# Altium schematic sheet 4_MOTORES_DC.SchDoc
size Tabloid; SheetNumber: 4; SheetTotal: 5; SPICEModelCacheNJINFHSP: <root> / <DocumentId>NJINFHSP</DocumentId> / <CacheFrame Number="0"> / <Model Name="0603_885012206121_330nf" Kind="CKT"> / <Text>******* / .subckt 0603_885012206121_330nF 1 2 / Rser 1 3 0.0116331902783 / Lser 2 4 2.98906197E-10 / C1 3 4 0.00000033 / Rpar 3 4 1500000000 / .ends 0603_885012206121_330nF</Text> / </Model> / <Model Name="865080645012_47uf" Kind="CKT"> / <Text>******* / .subckt 865080645012_47uF 1 2 / Rser 1 3 0.49 / Lser 2 4 0.000000002503 / C1 3 4 0.000047 / Rpar 3 4 2127659.57446809 / .ends 865080645012_47uF</Text> / </Model> / <Model Name="0603_150060rs75003" Kind="CKT"> / <Text>****** / .subckt 0603_150060RS75003  1  2 / D1 1 2 SMCW / .MODEL SMCW D / + IS=1.0025E-15 / + N=2.2259 / + RS=.3926 / + IKF=240.91E-6 / + CJO=1.0000E-12 / + M=.3333 / + VJ=.75 / + BV=5 / + IBV=10.00E-6 / + TT=5.0000E-9 / .ends</Text> / </Model> / <Model Name="0603_885012206049_330nf" Kind="CKT"> / <Text>******* / .subckt 0603_885012206049_330nF 1 2 / Rser 1 3 0.0117878976558 / Lser 2 4 3.9313295E-10 / C1 3 4 0.00000033 / Rpar 3 4 1500000000 / .ends 0603_885012206049_330nF</Text> / </Model> / <Model Name="0603_885012206040_10nf" Kind="CKT"> / <Text>******* / .subckt 0603_885012206040_10nF 1 2 / Rser 1 3 0.06145 / Lser 2 4 0.00000000036058 / C1 3 4 0.00000001 / Rpar 3 4 10000000000 / .ends 0603_885012206040_10nF</Text> / </Model> / <Model Name="0603_885012206034_1nf" Kind="CKT"> / <Text>******* / .subckt 0603_885012206034_1nF 1 2 / Rser 1 3 0.2266 / Lser 2 4 0.00000000040041 / C1 3 4 0.000000001 / Rpar 3 4 10000000000 / .ends 0603_885012206034_1nF</Text> / </Model> / </CacheFrame> / </root>
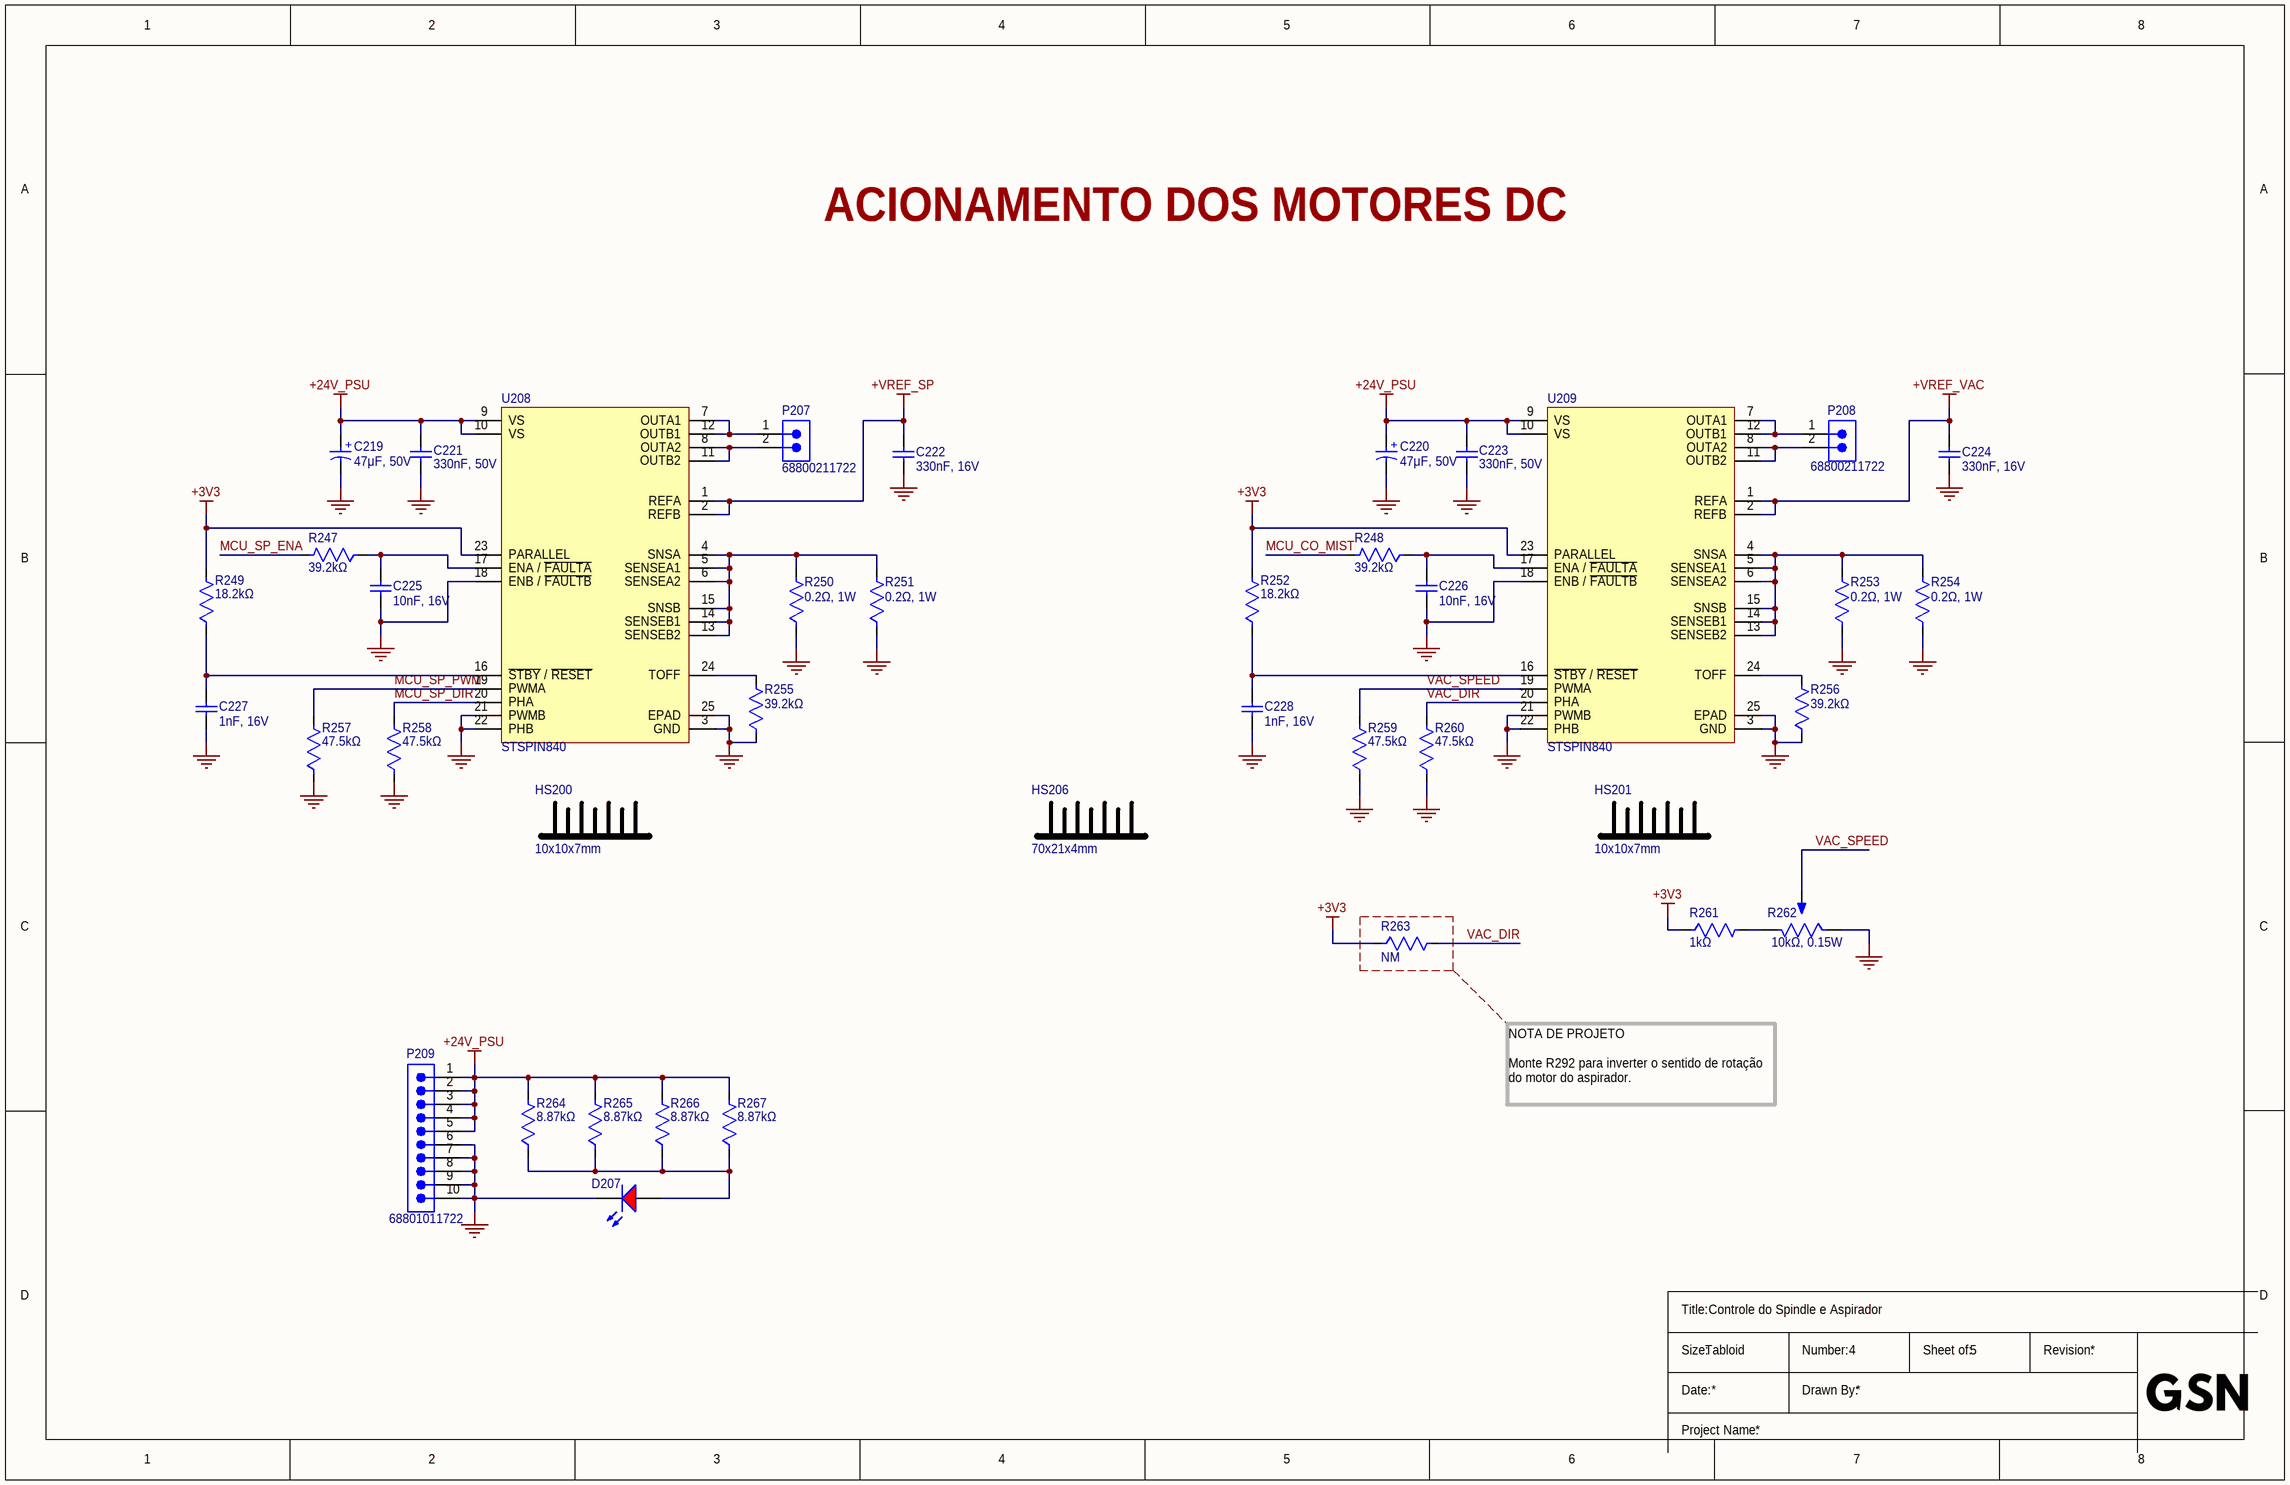
[diagram p0: 4_MOTORES_DC.SchDoc]

## Parts
C219  47μF, 50V  [WCAP-ASLI_D6.3H7.7]
C220  47μF, 50V  [WCAP-ASLI_D6.3H7.7]
C221  330nF, 50V  [WCAP-CSGP_0603_L1.6W0.8H0.8_Wave]
C222  330nF, 16V  [WCAP-CSGP_0603_L1.6W0.8H0.8_Wave]
C223  330nF, 50V  [WCAP-CSGP_0603_L1.6W0.8H0.8_Wave]
C224  330nF, 16V  [WCAP-CSGP_0603_L1.6W0.8H0.8_Wave]
C225  10nF, 16V  [WCAP-CSGP_0603_L1.6W0.8H0.8_Wave]
C226  10nF, 16V  [WCAP-CSGP_0603_L1.6W0.8H0.8_Wave]
C227  1nF, 16V  [WCAP-CSGP_0603_L1.6W0.8H0.8_Wave]
C228  1nF, 16V  [WCAP-CSGP_0603_L1.6W0.8H0.8_Wave]
D207  Red, 2V, 140deg  [WL-SMCW_0603_150060xx75003]  (value not drawn)
HS200  10x10x7mm  [HEATSINK_10MM_10MM_7MM]
HS201  10x10x7mm  [HEATSINK_10MM_10MM_7MM]
HS206  70x21x4mm  [HEATSINK_70MM_21MM_4MM]
P207  68800211722  [68800211722]
P208  68800211722  [68800211722]
P209  68801011722  [68801011722]
R247  39.2kΩ  [0603-WAVE]
R248  39.2kΩ  [0603-WAVE]
R249  18.2kΩ  [0603-WAVE]
R250  0.2Ω, 1W  [2512-WAVE]
R251  0.2Ω, 1W  [2512-WAVE]
R252  18.2kΩ  [0603-WAVE]
R253  0.2Ω, 1W  [2512-WAVE]
R254  0.2Ω, 1W  [2512-WAVE]
R255  39.2kΩ  [0603-WAVE]
R256  39.2kΩ  [0603-WAVE]
R257  47.5kΩ  [0603-WAVE]
R258  47.5kΩ  [0603-WAVE]
R259  47.5kΩ  [0603-WAVE]
R260  47.5kΩ  [0603-WAVE]
R261  1kΩ  [0603-WAVE]
R262  10kΩ, 0.15W  [TRIM-3P80MM_3P60MM]
R263  NM  [0603-WAVE]
R264  8.87kΩ  [0805-WAVE]
R265  8.87kΩ  [0805-WAVE]
R266  8.87kΩ  [0805-WAVE]
R267  8.87kΩ  [0805-WAVE]
U208  STSPIN840  [24-TQFPN]
U209  STSPIN840  [24-TQFPN]

## Nets
+3V3: R249.2 R252.2 R261.1 R263.1 U208.23(PARALLEL) U209.23(PARALLEL)
+24V_PSU: C219.1(P) C220.1(P) C221.2 C223.2 P209.1 P209.2 P209.3 P209.4 P209.5 R264.2 R265.2 R266.2 R267.2 U208.9(VS) U208.10(VS) U209.9(VS) U209.10(VS)
+VREF_SP: C222.2 U208.1(REFA) U208.2(REFB)
+VREF_VAC: C224.2 U209.1(REFA) U209.2(REFB)
GND: C219.2(N) C220.2(N) C221.1 C222.1 C223.1 C224.1 C225.1 C226.1 C227.1 C228.1 D207.2(K) P209.6 P209.7 P209.8 P209.9 P209.10 R250.1 R251.1 R253.1 R254.1 R255.1 R256.1 R257.1 R258.1 R259.1 R260.1 R262.1(CCW) U208.3(GND) U208.18(ENB_/_~{FAULTB}) U208.21(PWMB) U208.22(PHB) U208.25(EPAD) U209.3(GND) U209.18(ENB_/_~{FAULTB}) U209.21(PWMB) U209.22(PHB) U209.25(EPAD)
MCU_CO_MIST: R248.2
MCU_SP_DIR: R258.2 U208.20(PHA)
MCU_SP_ENA: R247.2
MCU_SP_PWM: R257.2 U208.19(PWMA)
VAC_DIR: R260.2 R263.2 U209.20(PHA)
VAC_SPEED: R259.2 R262.2(WIPER) U209.19(PWMA)
NetC225_2: C225.2 R247.1 U208.17(ENA_/_~{FAULTA})
NetC226_2: C226.2 R248.1 U209.17(ENA_/_~{FAULTA})
NetC227_2: C227.2 R249.1 U208.16(~{STBY}_/_~{RESET})
NetC228_2: C228.2 R252.1 U209.16(~{STBY}_/_~{RESET})
NetD207_1: D207.1(A) R264.1 R265.1 R266.1 R267.1
NetP207_1: P207.1 U208.7(OUTA1) U208.12(OUTB1)
NetP207_2: P207.2 U208.8(OUTA2) U208.11(OUTB2)
NetP208_1: P208.1 U209.7(OUTA1) U209.12(OUTB1)
NetP208_2: P208.2 U209.8(OUTA2) U209.11(OUTB2)
NetR250_2: R250.2 R251.2 U208.4(SNSA) U208.5(SENSEA1) U208.6(SENSEA2) U208.13(SENSEB2) U208.14(SENSEB1) U208.15(SNSB)
NetR253_2: R253.2 R254.2 U209.4(SNSA) U209.5(SENSEA1) U209.6(SENSEA2) U209.13(SENSEB2) U209.14(SENSEB1) U209.15(SNSB)
NetR255_2: R255.2 U208.24(TOFF)
NetR256_2: R256.2 U209.24(TOFF)
NetR261_2: R261.2 R262.3(CW)

## Notes on the sheet
- ACIONAMENTO DOS MOTORES DC
- NOTA DE PROJETO
  Monte R292 para inverter o sentido de rotação do motor do aspirador.
- Controle do Spindle e Aspirador
- Title:
- Size:
- Tabloid
- Number:
- Sheet of:
- Revision:
- Date:
- Project Name:
- Drawn By:
- (in symbol 865080645012) +

## Library data of the parts
C219 C220 = 865080645012: WCAP-ASLI Aluminum Electrolytic Capacitor, V-Chip, SMT, 6.3mm x 7.7mm, 47μF, 50V; Manufacturer: Wurth Elektronik; Capacitance: 47uF; Dissipation Factor: 12%; Endurance: 2000h; Impedance: 700mohm; Leakage Current: 23.5uA; Ripple Current: 230mA; Manufacturer Part Number: 865080645012; Category: Aluminum Electrolytic Capacitors; Match Code: WCAP-ASLI; ComponentLink1Description: Website Link; ComponentLink1URL: https://www.we-online.com/redexpert/article/865080645012?ad; ComponentLink2Description: Datasheet Link; ComponentLink2URL: https://www.we-online.com/redexpert/spec/865080645012?ad; Mount: Surface Mount; Operating Temperature Min: -55degC; Operating Temperature Max: 105degC; Packaging: Tape and Reel; Height: 7.7mm; Diameter: 6.3mm; Rated Voltage (DC): 50V
C221 C223 = 885012206121: WCAP-CSGP Multilayer Ceramic Chip Capacitor, General Purpose, size 0603, 330nF, 50V; Manufacturer: Wurth Elektronik; Case/Size Code: 0603; Capacitance Tolerance: +/-10%; Ceramic Type: X7R; Dissipation Factor: 10%; Insulation Resistance: 1.5GΩ; Technical Reference: X7R0603334K050DFCT10000; Manufacturer Part Number: 885012206121; Category: Multilayer Ceramic Chip Capacitors; Match Code: WCAP-CSGP; ComponentLink1Description: Website Link; ComponentLink1URL: https://www.we-online.com/redexpert/article/885012206121?ad; ComponentLink2Description: Datasheet Link; ComponentLink2URL: https://www.we-online.com/redexpert/spec/885012206121?ad; Mount: Surface Mount; Min Operating Temperature: -55°C; Max Operating Temperature: 125°C; Packaging: Tape and Reel; Length: 1.6mm; Width: 0.8mm; Height: 0.8mm; Capacitance: 330nF; Rated Voltage (DC): 50V
C222 C224 = 885012206049: WCAP-CSGP Multilayer Ceramic Chip Capacitor, General Purpose, size 0603, 330nF, 16V; Manufacturer: Wurth Elektronik; Case/Size Code: 0603; Capacitance Tolerance: +/-10%; Ceramic Type: X7R; Dissipation Factor: 5%; Insulation Resistance: 1.5Gohm; Technical Reference: X7R0603334K016DFCT10000; Manufacturer Part Number: 885012206049; Category: Multilayer Ceramic Chip Capacitors; Match Code: WCAP-CSGP; ComponentLink1Description: Website Link; ComponentLink1URL: https://www.we-online.com/redexpert/article/885012206049?ad; ComponentLink2Description: Datasheet Link; ComponentLink2URL: https://www.we-online.com/redexpert/spec/885012206049?ad; Mount: Surface Mount; Operating Temperature Min: -55degC; Operating Temperature Max: 125degC; Packaging: Tape and Reel; Length: 1.6mm; Width: 0.8mm; Height: 0.8mm; Capacitance: 330nF; Rated Voltage (DC): 16V
C225 C226 = 885012206040: WCAP-CSGP Multilayer Ceramic Chip Capacitor, General Purpose, size 0603, 10nF, 16V; Manufacturer: Wurth Elektronik; Case/Size Code: 0603; Capacitance Tolerance: +/-10%; Ceramic Type: X7R; Dissipation Factor: 3.5%; Insulation Resistance: 10Gohm; Technical Reference: X7R0603103K016DFCT10000; Manufacturer Part Number: 885012206040; Category: Multilayer Ceramic Chip Capacitors; Match Code: WCAP-CSGP; ComponentLink1Description: Website Link; ComponentLink1URL: https://www.we-online.com/redexpert/article/885012206040?ad; ComponentLink2Description: Datasheet Link; ComponentLink2URL: https://www.we-online.com/redexpert/spec/885012206040?ad; Mount: Surface Mount; Operating Temperature Min: -55degC; Operating Temperature Max: 125degC; Packaging: Tape and Reel; Length: 1.6mm; Width: 0.8mm; Height: 0.8mm; Capacitance: 10nF; Rated Voltage (DC): 16V
C227 C228 = 885012206034: WCAP-CSGP Multilayer Ceramic Chip Capacitor, General Purpose, size 0603, 1nF, 16V; Manufacturer: Wurth Elektronik; Case/Size Code: 0603; Capacitance Tolerance: +/-10%; Ceramic Type: X7R; Dissipation Factor: 3.5%; Insulation Resistance: 10Gohm; Technical Reference: X7R0603102K016DFCT10000; Manufacturer Part Number: 885012206034; Category: Multilayer Ceramic Chip Capacitors; Match Code: WCAP-CSGP; ComponentLink1Description: Website Link; ComponentLink1URL: https://www.we-online.com/redexpert/article/885012206034?ad; ComponentLink2Description: Datasheet Link; ComponentLink2URL: https://www.we-online.com/redexpert/spec/885012206034?ad; Mount: Surface Mount; Operating Temperature Min: -55degC; Operating Temperature Max: 125degC; Packaging: Tape and Reel; Length: 1.6mm; Width: 0.8mm; Height: 0.8mm; Capacitance: 1nF; Rated Voltage (DC): 16V
D207 = 150060RS75003: WL-SMCW Mono-color Chip LED Waterclear, SMT, size 0603, Red, 2V, 140°; Manufacturer: Wurth Elektronik; Case/Size Code: 0603; Chip Technology: AlInGaP; Dominant Wavelength: 625nm; Luminous Intensity: 530mcd; Peak Wavelength: 630nm; Manufacturer Part Number: 150060RS75003; Category: Signal LEDs; Match Code: WL-SMCW; ComponentLink1Description: Website Link; ComponentLink1URL: https://www.we-online.com/redexpert/article/150060RS75003?ad; ComponentLink2Description: Datasheet Link; ComponentLink2URL: https://www.we-online.com/redexpert/spec/150060RS75003?ad; Mount: Surface Mount; Operating Temperature Min: -40degC; Operating Temperature Max: 100degC; Packaging: Tape and Reel; Length: 1.6mm; Width: 0.8mm; Height: 0.7mm; Emitting Color: Red; Forward Voltage: 2V; Viewing Angle: 140deg
HS200 HS201 = GENERIC-HEATSINK-10X10X7MM: GENERIC HEATSINK 10X10X7MM; Manufacturer: OEM; Manufacturer Part Number: None
HS206 = GENERIC-HEATSINK-70X21X4MM: GENERIC HEATSINK 70X21X4MM; Manufacturer: OEM; Manufacturer Part Number: None
P207 P208 = 68800211722: WR-WTB “J” Type THT Male Horizontal Shrouded Header, pitch 2.5 mm, 2 pins; Manufacturer: Wurth Elektronik; Contact Resistance: 20 mohm; Rated Current: 3 A; Working Voltage: 250 V(AC); Withstanding Voltage: 800 V(AC); Manufacturer Part Number: 68800211722; Category: Wire-to-Board Connector; Match Code: WR-WTB; ComponentLink1Description: Website Link; ComponentLink1URL: https://www.we-online.com/redexpert/article/68800211722?ad; ComponentLink2Description: Datasheet Link; ComponentLink2URL: https://www.we-online.com/redexpert/spec/68800211722?ad; Mount: Through Hole; Operating Temperature Min: -25degC; Operating Temperature Max: 85degC; Packaging: Bag; Length: 7.5 mm; Width: 8.3 mm; Height: 4.2 mm; Gender: Male; Number of Pins: 2; Number of Rows: 1; Orientation: Horizontal; Lead Pitch: 2.5 mm
P209 = 68801011722: WR-WTB “J” Type THT Male Horizontal Shrouded Header, pitch 2.5 mm, 10 pins; Manufacturer: Wurth Elektronik; Contact Resistance: 20 mohm; Rated Current: 3 A; Working Voltage: 250 V(AC); Withstanding Voltage: 800 V(AC); Manufacturer Part Number: 68801011722; Category: Wire-to-Board Connector; Match Code: WR-WTB; ComponentLink1Description: Website Link; ComponentLink1URL: https://www.we-online.com/redexpert/article/68801011722?ad; ComponentLink2Description: Datasheet Link; ComponentLink2URL: https://www.we-online.com/redexpert/spec/68801011722?ad; Mount: Through Hole; Operating Temperature Min: -25degC; Operating Temperature Max: 85degC; Packaging: Bag; Length: 27.5 mm; Width: 8.3 mm; Height: 4.2 mm; Gender: Male; Number of Pins: 10; Number of Rows: 1; Orientation: Horizontal; Lead Pitch: 2.5 mm
R247 R248 R255 R256 = RC0603FR-0739K2L: RES 39.2K OHM 1% 1/10W 0603; Manufacturer: Yageo Group; Max Power Dissipation: 100mW; Temperature Coefficient: ±200ppm/°C; Voltage Rating (AC): 50V; Voltage Rating: 75V; Supplier Part Number: 311-39.2KHRCT-ND; Manufacturer Part Number: RC0603FR-0739K2L; Value: 39.2kΩ; Case Code (Imperial): 0603; Case Code (Metric): 1608; Case/Package: 0603; Category: Chip SMD Resistors; China RoHS: Non-Compliant; Composition: Thick Film; Contact Plating: Tin; Depth: 800µm; Features: Moisture Resistant; Height: 450µm; Lead Free: Lead Free; Length: 1.6mm; Lifecycle Status: Production; Max Operating Temperature: 155°C; Military Standard: Not; Min Operating Temperature: -55°C; Mounting Technology: Surface Mount; Number of Terminals: 2; Number of Terminations: 2; Packaging: Tape & Reel; Power Dissipation: 100mW; Power Rating: 100mW; Radiation Hardening: No; REACH SVHC: Yes; RoHS: Compliant; Supplier: DigiKey; Termination: SMD/SMT; Tolerance: 1%; Component Link Description: https://www.yageogroup.com/content/datasheet/asset/file/PYU-RC_GROUP_51_ROHS_L; Component Link URL: https://www.yageogroup.com/content/datasheet/asset/file/PYU-RC_GROUP_51_ROHS_L; Datasheet: https://www.yageogroup.com/content/datasheet/asset/file/PYU-RC_GROUP_51_ROHS_L; Voltage Rating (DC): 50V; Weight: 2.012816mg; Width: 800µm; Working Voltage: 75V
R249 R252 = RC0603FR-0718K2L: RES 18.2K OHM 1% 1/10W 0603; Manufacturer: Yageo Group; Max Power Dissipation: 100mW; Temperature Coefficient: ±200ppm/°C; Voltage Rating (AC): 50V; Voltage Rating: 75V; Supplier Part Number: 311-18.2KHRCT-ND; Manufacturer Part Number: RC0603FR-0718K2L; Value: 18.2kΩ; Case Code (Imperial): 0603; Case Code (Metric): 1608; Case/Package: 0603; Category: Chip SMD Resistors; China RoHS: Non-Compliant; Composition: Thick Film; Contact Plating: Tin; Depth: 800µm; Features: Moisture Resistant; Height: 450µm; Lead Free: Lead Free; Length: 1.6mm; Lifecycle Status: Production; Max Operating Temperature: 155°C; Military Standard: Not; Min Operating Temperature: -55°C; Mounting Technology: Surface Mount; Number of Terminals: 2; Number of Terminations: 2; Packaging: Tape & Reel; Power Dissipation: 100mW; Power Rating: 100mW; Radiation Hardening: No; REACH SVHC: Yes; RoHS: Compliant; Supplier: DigiKey; Termination: SMD/SMT; Tolerance: 1%; Component Link Description: https://www.yageogroup.com/content/datasheet/asset/file/PYU-RC_GROUP_51_ROHS_L; Component Link URL: https://www.yageogroup.com/content/datasheet/asset/file/PYU-RC_GROUP_51_ROHS_L; Datasheet: https://www.yageogroup.com/content/datasheet/asset/file/PYU-RC_GROUP_51_ROHS_L; Voltage Rating (DC): 50V; Weight: 2.012816mg; Width: 800µm; Working Voltage: 75V
R250 R251 R253 R254 = RL2512FK-070R2L: RES 0.2 OHM 1% 1W 2512; Manufacturer: Yageo Group; Value: 200mΩ; Temperature Coefficient: 600ppm/°C; Working Voltage: 447.2mV; Supplier: DigiKey; Supplier Part Number: 311-0.2TCT-ND; Manufacturer Part Number: RL2512FK-070R2L; RoHS: Compliant; Category: Chip SMD Resistors; Stock: 22890; Pricing: 1=0.44, 10=0.249, 25=0.206, 50=0.1814, 100=0.1618, 250=0.142, 500=0.13056, 1000=0.12148 (USD); Case/Package: 2512; Case Code (Imperial): 2512; Case Code (Metric): 6332; China RoHS: Non-Compliant; Composition: Thick Film; Contact Plating: Lead, Tin; Country of Origin: Mainland China, Taiwan; Depth: 3.2mm; Export Control Classification Number (ECCN) Code: EAR99; Height: 550µm; Harmonized Tariff Schedule (HTS) Code: 8533.21.00.30; Introduction Date: 2005-04-15; Lead Free: Lead Free; Length: 6.35mm; Lifecycle Status: Production; Max Operating Temperature: 155°C; Military Standard: Not; Min Operating Temperature: -55°C; Mounting Technology: Surface Mount; Number of Terminals: 2; Power Rating: 1W; Ratings: AEC-Q200; REACH SVHC: Yes; Schedule B: 8533210045, 8533210045|8533210045, 8533210045|8533210045|8533210045, 8533210045|8533210045|8533210045|8533210045; Termination: SMD/SMT; Tolerance: 1%; Weight: 40.511469mg; Width: 3.2mm; ComponentLink1URL: https://datasheet.octopart.com:443/RL2512FK-070R2L-Yageo-datasheet-182189623.pdf?src-supplier=IHS; ComponentLink1Description: https://datasheet.octopart.com:443/RL2512FK-070R2L-Yageo-datasheet-182189623.pdf?src-supplier=IHS; ComponentLink2URL: https://datasheet.octopart.com:443/RL2512FK-070R2L-Yageo-datasheet-83209227.pdf?src-supplier=LCSC; ComponentLink2Description: https://datasheet.octopart.com:443/RL2512FK-070R2L-Yageo-datasheet-83209227.pdf?src-supplier=LCSC; ComponentLink3URL: https://datasheet.octopart.com:443/RL2512FK-070R2L-Yageo-Group-datasheet-178203169.pdf?src-supplier=Future+Electronics; ComponentLink3Description: https://datasheet.octopart.com:443/RL2512FK-070R2L-Yageo-Group-datasheet-178203169.pdf?src-supplier=Future+Electronics; ComponentLink4URL: https://datasheet.octopart.com:443/RL2512FK-070R2L-Yageo-datasheet-137700928.pdf?src-supplier=Future+Electronics; ComponentLink4Description: https://datasheet.octopart.com:443/RL2512FK-070R2L-Yageo-datasheet-137700928.pdf?src-supplier=Future+Electronics; ComponentLink5URL: https://datasheet.octopart.com:443/RL2512FK-070R2L-Yageo-datasheet-42224166.pdf?src-supplier=Future+Electronics; ComponentLink5Description: https://datasheet.octopart.com:443/RL2512FK-070R2L-Yageo-datasheet-42224166.pdf?src-supplier=Future+Electronics; ComponentLink6URL: https://datasheet.octopart.com:443/RL2512FK-070R2L-Yageo-datasheet-21255488.pdf?src-supplier=Future+Electronics; ComponentLink6Description: https://datasheet.octopart.com:443/RL2512FK-070R2L-Yageo-datasheet-21255488.pdf?src-supplier=Future+Electronics; ComponentLink7URL: https://datasheet.octopart.com:443/RL2512FK-070R2L-Yageo-datasheet-12526708.pdf?src-supplier=Future+Electronics; ComponentLink7Description: https://datasheet.octopart.com:443/RL2512FK-070R2L-Yageo-datasheet-12526708.pdf?src-supplier=Future+Electronics; ComponentLink8URL: https://datasheet.octopart.com:443/RL2512FK-070R2L-Yageo-datasheet-12521612.pdf?src-supplier=Future+Electronics; ComponentLink8Description: https://datasheet.octopart.com:443/RL2512FK-070R2L-Yageo-datasheet-12521612.pdf?src-supplier=Future+Electronics; ComponentLink9URL: https://datasheet.octopart.com/RL2512FK-070R2L-Yageo-datasheet-10916029.pdf; ComponentLink9Description: https://datasheet.octopart.com/RL2512FK-070R2L-Yageo-datasheet-10916029.pdf; ComponentLink10URL: http://sigma.octopart.com:80/conflict_mineral_statement/Yageo-company-3.pdf?src-supplier=Compliance+Statements; ComponentLink10Description: http://sigma.octopart.com:80/conflict_mineral_statement/Yageo-company-3.pdf?src-supplier=Compliance+Statements; ComponentLink11URL: http://sigma.octopart.com:80/rohs_statement/Yageo-company-2.pdf?src-supplier=Compliance+Statements; ComponentLink11Description: http://sigma.octopart.com:80/rohs_statement/Yageo-company-2.pdf?src-supplier=Compliance+Statements
R257-R260 = RC0603FR-0747K5L: RES 47.5K OHM 1% 1/10W 0603; Manufacturer: Yageo Group; Max Power Dissipation: 100mW; Temperature Coefficient: ±200ppm/°C; Voltage Rating (AC): 50V; Voltage Rating: 75V; Supplier Part Number: 311-47.5KHRCT-ND; Manufacturer Part Number: RC0603FR-0747K5L; Value: 47.5kΩ; Case Code (Imperial): 0603; Case Code (Metric): 1608; Case/Package: 0603; Category: Chip SMD Resistors; China RoHS: Non-Compliant; Composition: Thick Film; Contact Plating: Tin; Depth: 800µm; Features: Moisture Resistant; Height: 450µm; Lead Free: Lead Free; Length: 1.6mm; Lifecycle Status: Production; Max Operating Temperature: 155°C; Military Standard: Not; Min Operating Temperature: -55°C; Mounting Technology: Surface Mount; Number of Terminals: 2; Number of Terminations: 2; Packaging: Tape & Reel; Power Dissipation: 100mW; Power Rating: 100mW; Radiation Hardening: No; REACH SVHC: Yes; RoHS: Compliant; Supplier: DigiKey; Termination: SMD/SMT; Tolerance: 1%; Component Link Description: https://www.yageogroup.com/content/datasheet/asset/file/PYU-RC_GROUP_51_ROHS_L; Component Link URL: https://www.yageogroup.com/content/datasheet/asset/file/PYU-RC_GROUP_51_ROHS_L; Datasheet: https://www.yageogroup.com/content/datasheet/asset/file/PYU-RC_GROUP_51_ROHS_L; Voltage Rating (DC): 50V; Weight: 2.012816mg; Width: 800µm; Working Voltage: 75V
R261 = RC0603FR-071KL: RES 1K OHM 1% 1/10W 0603; Manufacturer: Yageo Group; Max Power Dissipation: 100mW; Temperature Coefficient: ±200ppm/°C; Voltage Rating (AC): 50V; Voltage Rating: 75V; Supplier Part Number: 311-1.00KHRCT-ND; Manufacturer Part Number: RC0603FR-071KL; Value: 1kΩ; Case Code (Imperial): 0603; Case Code (Metric): 1608; Case/Package: 0603; Category: Chip SMD Resistors; China RoHS: Non-Compliant; Composition: Thick Film; Contact Plating: Tin; Depth: 800µm; Features: Moisture Resistant; Height: 450µm; Lead Free: Lead Free; Length: 1.6mm; Lifecycle Status: Production; Max Operating Temperature: 155°C; Military Standard: Not; Min Operating Temperature: -55°C; Mounting Technology: Surface Mount; Number of Terminals: 2; Number of Terminations: 2; Packaging: Tape & Reel; Power Dissipation: 100mW; Power Rating: 100mW; Radiation Hardening: No; REACH SVHC: Yes; RoHS: Compliant; Supplier: DigiKey; Termination: SMD/SMT; Tolerance: 1%; Component Link Description: https://www.yageogroup.com/content/datasheet/asset/file/PYU-RC_GROUP_51_ROHS_L; Component Link URL: https://www.yageogroup.com/content/datasheet/asset/file/PYU-RC_GROUP_51_ROHS_L; Datasheet: https://www.yageogroup.com/content/datasheet/asset/file/PYU-RC_GROUP_51_ROHS_L; Voltage Rating (DC): 50V; Weight: 2.012816mg; Width: 800µm; Working Voltage: 75V
R262 = TC33X-2-103E: TRIMMER 10K OHM 0.15W J LEAD TOP; Manufacturer: Bourns; Max Power Dissipation: 100mW; Number of Turns: 1; Power Dissipation: 150mW; Temperature Coefficient: 250ppm/°C; Tolerance: 25%; Voltage Rating (DC): 50V; Supplier: DigiKey; Supplier Part Number: TC33X-103ECT-ND; Manufacturer Part Number: TC33X-2-103E; RoHS: Compliant; Category: Variable Resistors and Potentiometers; Stock: 18061; Pricing: 1=0.25, 10=0.213, 25=0.1996, 50=0.1896, 100=0.18, 250=0.168, 500=0.15938, 1000=0.15119 (USD); Color: Silver; Composition: Cermet, Potentiometer; Contact Plating: Copper, Silver, Tin; Depth: 3.8mm; Height: 1.2mm; Lead Free: Lead Free; Length: 3mm; Lifecycle Status: Production; Max Operating Temperature: 100°C; Military Standard: Not; Min Operating Temperature: -40°C; Mounting Technology: Surface Mount; Number of Terminals: 3; Packaging: Cut Tape; Power Rating: 100mW; Radiation Hardening: No; REACH SVHC: Yes; Value: 10kΩ; Schedule B: 8533400080, 8533400080|8533400080|8533400080|8533400080|8533400080; Taper: Linear; Termination: Foot Print; Weight: 29.4mg; Width: 3.6mm; Working Voltage: 50V; ComponentLink1URL: https://datasheet.octopart.com:443/TC33X-2-103E-Bourns-datasheet-182142024.pdf?src-supplier=IHS; ComponentLink1Description: https://datasheet.octopart.com:443/TC33X-2-103E-Bourns-datasheet-182142024.pdf?src-supplier=IHS; ComponentLink2URL: https://datasheet.octopart.com:443/TC33X-2-103E-Bourns-datasheet-134530277.pdf?src-supplier=Upverter; ComponentLink2Description: https://datasheet.octopart.com:443/TC33X-2-103E-Bourns-datasheet-134530277.pdf?src-supplier=Upverter; ComponentLink3URL: https://datasheet.octopart.com:443/TC33X-2-103E-Bourns-datasheet-11551316.pdf?src-supplier=element14+APAC; ComponentLink3Description: https://datasheet.octopart.com:443/TC33X-2-103E-Bourns-datasheet-11551316.pdf?src-supplier=element14+APAC; ComponentLink4URL: https://datasheet.octopart.com:443/TC33X-2-103E-Bourns-datasheet-65566108.pdf?src-supplier=element14+APAC; ComponentLink4Description: https://datasheet.octopart.com:443/TC33X-2-103E-Bourns-datasheet-65566108.pdf?src-supplier=element14+APAC; ComponentLink5URL: https://datasheet.octopart.com:443/TC33X-2-103E-Bourns-datasheet-67039831.pdf?src-supplier=Farnell; ComponentLink5Description: https://datasheet.octopart.com:443/TC33X-2-103E-Bourns-datasheet-67039831.pdf?src-supplier=Farnell; ComponentLink6URL: https://datasheet.octopart.com:443/TC33X-2-103E-Bourns-datasheet-164917123.pdf?src-supplier=Farnell; ComponentLink6Description: https://datasheet.octopart.com:443/TC33X-2-103E-Bourns-datasheet-164917123.pdf?src-supplier=Farnell; ComponentLink7URL: https://datasheet.octopart.com:443/TC33X-2-103E-Bourns-datasheet-38800.pdf?src-supplier=Farnell; ComponentLink7Description: https://datasheet.octopart.com:443/TC33X-2-103E-Bourns-datasheet-38800.pdf?src-supplier=Farnell; ComponentLink8URL: https://datasheet.octopart.com:443/TC33X-2-103E-Bourns-datasheet-26822215.pdf?src-supplier=Newark; ComponentLink8Description: https://datasheet.octopart.com:443/TC33X-2-103E-Bourns-datasheet-26822215.pdf?src-supplier=Newark; ComponentLink9URL: https://datasheet.octopart.com:443/TC33X-2-103E-Bourns-datasheet-41964919.pdf?src-supplier=Newark; ComponentLink9Description: https://datasheet.octopart.com:443/TC33X-2-103E-Bourns-datasheet-41964919.pdf?src-supplier=Newark; ComponentLink10URL: https://datasheet.octopart.com:443/TC33X-2-103E-Bourns-datasheet-154730028.pdf?src-supplier=Electro+Sonic; ComponentLink10Description: https://datasheet.octopart.com:443/TC33X-2-103E-Bourns-datasheet-154730028.pdf?src-supplier=Electro+Sonic; ComponentLink11URL: https://datasheet.octopart.com:443/TC33X-2-103E-Bourns-datasheet-47549324.pdf?src-supplier=RS+(Formerly+Allied+Electronics); ComponentLink11Description: https://datasheet.octopart.com:443/TC33X-2-103E-Bourns-datasheet-47549324.pdf?src-supplier=RS+(Formerly+Allied+Electronics); ComponentLink12URL: https://datasheet.octopart.com:443/TC33X-2-103E-Bourns-datasheet-549861.pdf?src-supplier=RS+(Formerly+Allied+Electronics); ComponentLink12Description: https://datasheet.octopart.com:443/TC33X-2-103E-Bourns-datasheet-549861.pdf?src-supplier=RS+(Formerly+Allied+Electronics); ComponentLink13URL: https://datasheet.octopart.com:443/TC33X-2-103E-Bourns-datasheet-5319878.pdf?src-supplier=element14; ComponentLink13Description: https://datasheet.octopart.com:443/TC33X-2-103E-Bourns-datasheet-5319878.pdf?src-supplier=element14; ComponentLink14URL: https://datasheet.octopart.com:443/TC33X-2-103E-Bourns-datasheet-177040515.pdf?src-supplier=Burklin+Elektronik; ComponentLink14Description: https://datasheet.octopart.com:443/TC33X-2-103E-Bourns-datasheet-177040515.pdf?src-supplier=Burklin+Elektronik; ComponentLink15URL: https://datasheet.octopart.com:443/TC33X-2-103E-Bourns-datasheet-39003.pdf?src-supplier=Mouser; ComponentLink15Description: https://datasheet.octopart.com:443/TC33X-2-103E-Bourns-datasheet-39003.pdf?src-supplier=Mouser; ComponentLink16URL: http://sigma.octopart.com:80/conflict_mineral_statement/Bourns-company-36.pdf?src-supplier=Compliance+Statements; ComponentLink16Description: http://sigma.octopart.com:80/conflict_mineral_statement/Bourns-company-36.pdf?src-supplier=Compliance+Statements
R263 = RC0603FR-070RL: RES 0 OHM 1% 1/10W 0603; Manufacturer: Yageo Group; Max Power Dissipation: 100mW; Temperature Coefficient: ±200ppm/°C; Voltage Rating (AC): 50V; Voltage Rating: 75V; Supplier Part Number: 311-0.0HRCT-ND; Manufacturer Part Number: RC0603FR-070RL; Value: NM; Case Code (Imperial): 0603; Case Code (Metric): 1608; Case/Package: 0603; Category: Chip SMD Resistors; China RoHS: Non-Compliant; Composition: Thick Film; Contact Plating: Tin; Depth: 800µm; Features: Moisture Resistant; Height: 450µm; Lead Free: Lead Free; Length: 1.6mm; Lifecycle Status: Production; Max Operating Temperature: 155°C; Military Standard: Not; Min Operating Temperature: -55°C; Mounting Technology: Surface Mount; Number of Terminals: 2; Number of Terminations: 2; Packaging: Tape & Reel; Power Dissipation: 100mW; Power Rating: 100mW; Radiation Hardening: No; REACH SVHC: Yes; RoHS: Compliant; Supplier: DigiKey; Termination: SMD/SMT; Tolerance: 1%; Component Link Description: https://www.yageogroup.com/content/datasheet/asset/file/PYU-RC_GROUP_51_ROHS_L; Component Link URL: https://www.yageogroup.com/content/datasheet/asset/file/PYU-RC_GROUP_51_ROHS_L; Datasheet: https://www.yageogroup.com/content/datasheet/asset/file/PYU-RC_GROUP_51_ROHS_L; Voltage Rating (DC): 50V; Weight: 2.012816mg; Width: 800µm; Working Voltage: 75V
R264-R267 = RC0805FR-078K87L: RES 8.87K OHM 1% 1/8W 0805; Manufacturer: Yageo Group; Max Power Dissipation: 125mW; Temperature Coefficient: 100ppm/°C; Voltage Rating: 150V; Supplier: DigiKey; Supplier Part Number: 311-8.87KCRCT-ND; Manufacturer Part Number: RC0805FR-078K87L; RoHS: Compliant; Category: Chip SMD Resistors; Stock: 98675; Pricing: 1=0.1, 10=0.008, 25=0.0072 (USD); Case/Package: 0805; Case Code (Imperial): 0805; China RoHS: Non-Compliant; Composition: Thick Film; Contact Plating: Lead, Tin; Depth: 1.25mm; Features: Moisture Resistant; Height: 500µm; Lead Free: Lead Free; Length: 2mm; Lifecycle Status: Production; Max Operating Temperature: 155°C; Military Standard: Not; Min Operating Temperature: -55°C; Mounting Technology: Surface Mount; Number of Terminals: 2; Number of Terminations: 2; Power Dissipation: 125mW; Power Rating: 125mW; Radiation Hardening: No; REACH SVHC: Yes; Value: 8.87kΩ; Schedule B: 8533210045, 8533210045|8533210045|8533210045|8533210045|8533210045; Termination: SMD/SMT; Tolerance: 1%; Voltage Rating (DC): 150V; Width: 1.25mm; Working Voltage: 150V; ComponentLink1URL: https://datasheet.octopart.com:443/RC0805FR-078K87L-Yageo-datasheet-175887523.pdf?src-supplier=Newark; ComponentLink1Description: https://datasheet.octopart.com:443/RC0805FR-078K87L-Yageo-datasheet-175887523.pdf?src-supplier=Newark; ComponentLink2URL: https://datasheet.octopart.com:443/RC0805FR-078K87L-Yageo-datasheet-103092701.pdf?src-supplier=Upverter; ComponentLink2Description: https://datasheet.octopart.com:443/RC0805FR-078K87L-Yageo-datasheet-103092701.pdf?src-supplier=Upverter; ComponentLink3URL: https://datasheet.octopart.com:443/RC0805FR-078K87L-Yageo-Group-datasheet-176638170.pdf?src-supplier=Future+Electronics; ComponentLink3Description: https://datasheet.octopart.com:443/RC0805FR-078K87L-Yageo-Group-datasheet-176638170.pdf?src-supplier=Future+Electronics; ComponentLink4URL: https://datasheet.octopart.com:443/RC0805FR-078K87L-Yageo-datasheet-164759695.pdf?src-supplier=Future+Electronics; ComponentLink4Description: https://datasheet.octopart.com:443/RC0805FR-078K87L-Yageo-datasheet-164759695.pdf?src-supplier=Future+Electronics; ComponentLink5URL: https://datasheet.octopart.com:443/RC0805FR-078K87L-Yageo-datasheet-12592811.pdf?src-supplier=Future+Electronics; ComponentLink5Description: https://datasheet.octopart.com:443/RC0805FR-078K87L-Yageo-datasheet-12592811.pdf?src-supplier=Future+Electronics; ComponentLink6URL: https://datasheet.octopart.com:443/RC0805FR-078K87L-Yageo-datasheet-8330313.pdf?src-supplier=Future+Electronics; ComponentLink6Description: https://datasheet.octopart.com:443/RC0805FR-078K87L-Yageo-datasheet-8330313.pdf?src-supplier=Future+Electronics; ComponentLink7URL: https://datasheet.octopart.com:443/RC0805FR-078K87L-Yageo-datasheet-8324252.pdf?src-supplier=Future+Electronics; ComponentLink7Description: https://datasheet.octopart.com:443/RC0805FR-078K87L-Yageo-datasheet-8324252.pdf?src-supplier=Future+Electronics; ComponentLink8URL: https://datasheet.octopart.com/RC0805FR-078K87L-Yageo-datasheet-73766026.pdf; ComponentLink8Description: https://datasheet.octopart.com/RC0805FR-078K87L-Yageo-datasheet-73766026.pdf; ComponentLink9URL: https://datasheet.octopart.com:443/RC0805FR-078K87L-Yageo-datasheet-118657.pdf?src-supplier=DigiKey; ComponentLink9Description: https://datasheet.octopart.com:443/RC0805FR-078K87L-Yageo-datasheet-118657.pdf?src-supplier=DigiKey; ComponentLink10URL: http://sigma.octopart.com:80/conflict_mineral_statement/Yageo-company-3.pdf?src-supplier=Compliance+Statements; ComponentLink10Description: http://sigma.octopart.com:80/conflict_mineral_statement/Yageo-company-3.pdf?src-supplier=Compliance+Statements; ComponentLink11URL: http://sigma.octopart.com:80/rohs_statement/Yageo-company-2.pdf?src-supplier=Compliance+Statements; ComponentLink11Description: http://sigma.octopart.com:80/rohs_statement/Yageo-company-2.pdf?src-supplier=Compliance+Statements
U208 U209 = STSPIN840: IC MOTOR DRIVER 7V-45V 24TQFPN; Manufacturer: STMicroelectronics; Drain to Source Resistance: 500mΩ; Interface: Parallel; Max Output current: 1.5A; Max Supply Voltage: 45V; Min Supply Voltage: 7V; Number of Circuits: 1; Operating Supply Voltage: 36V; Output Voltage: 48V; Supplier: DigiKey; Supplier Part Number: 497-18119-1-ND; Manufacturer Part Number: STSPIN840; RoHS: Compliant; Category: Motor Drivers; Stock: 9342; Pricing: 1=2.95, 10=2.208, 25=2.022, 100=1.8174, 250=1.71984, 500=1.66102, 1000=1.61261 (USD); China RoHS: Compliant; Height - Seated (Max): 1.1mm; Length: 4mm; Lifecycle Status: Production; Max Operating Temperature: 150°C; Min Operating Temperature: -40°C; Number of Terminals: 24; Output Current: 1.5A; REACH SVHC: Yes; Schedule B: 8542390000, 8542390000|8542390000|8542390000|8542390000|8542390000; Terminal Pitch: 500µm; Width: 4mm; ComponentLink1URL: https://datasheet.octopart.com:443/STSPIN840-STMicroelectronics-datasheet-116891059.pdf?src-supplier=ODG+(Origin+Data+Global); ComponentLink1Description: https://datasheet.octopart.com:443/STSPIN840-STMicroelectronics-datasheet-116891059.pdf?src-supplier=ODG+(Origin+Data+Global)